# EAGLE design BSPD Test Board rev4 (EAGLE 8.4.1)
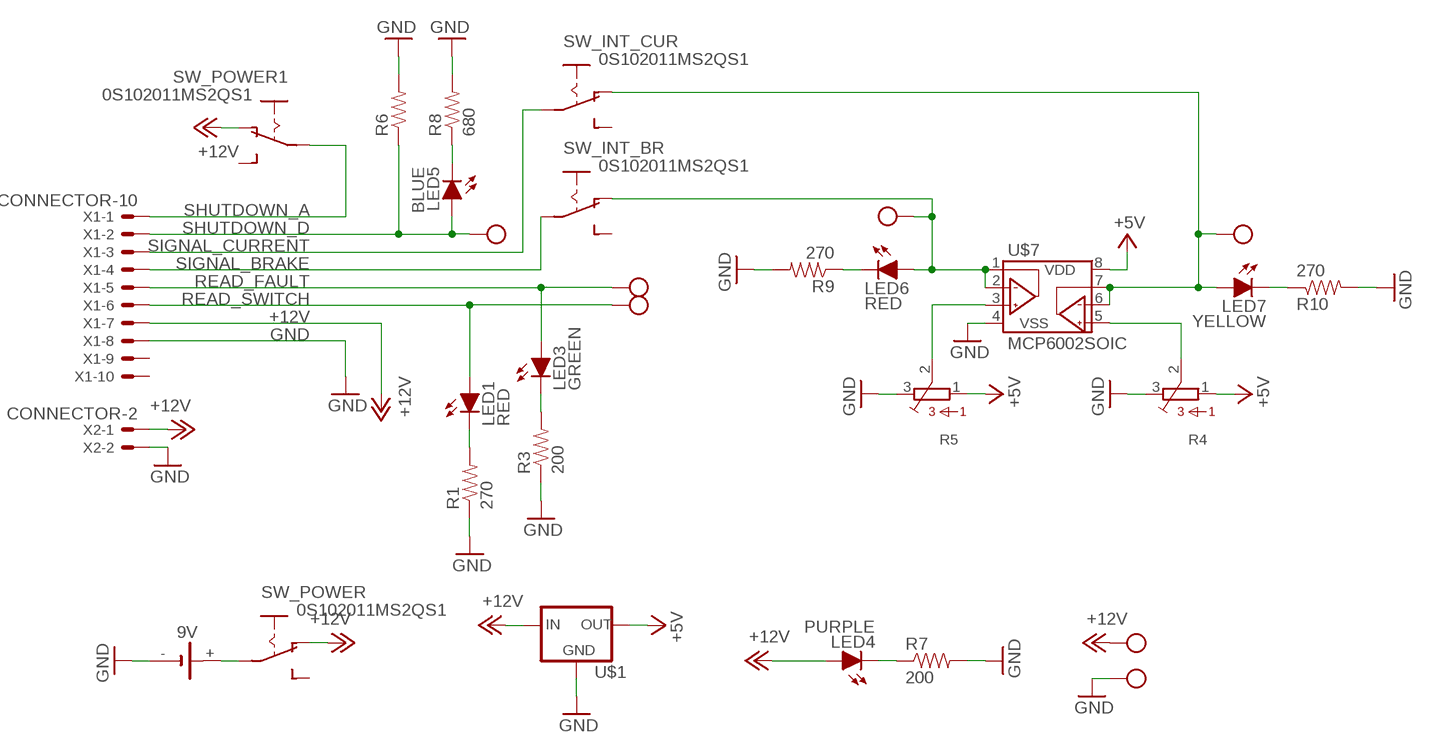
[diagram p0: schematic, sheet 1]

## Parts
9V  1291-79  [1291-79]
LED1  RED  LED-5MM  [LED-5MM]
LED3  GREEN  LED-5MM  [LED-5MM]
LED4  PURPLE  LED-0805  [LED-805]
LED5  BLUE  LED-5MM  [LED-5MM]
LED6  RED  LED-0805  [LED-805]
LED7  YELLOW  LED-0805  [LED-805]
R1  270  RESISTOR0805-RES  [0805]
R3  200  RESISTOR0805-RES  [0805]
R4  TRIMPOT_3296C  [TRIMPOT_3296]
R5  TRIMPOT_3296C  [TRIMPOT_3296]
R6  RESISTORPTH-1/2W  [AXIAL-0.5]
R7  200  RESISTOR0805-RES  [0805]
R8  680  RESISTOR0805-RES  [0805]
R9  270  RESISTOR0805-RES  [0805]
R10  270  RESISTOR0805-RES  [0805]
SW_INT_BR  0S102011MS2QS1  [0S102011MS2QS1]
SW_INT_CUR  0S102011MS2QS1  [0S102011MS2QS1]
SW_POWER  0S102011MS2QS1  [0S102011MS2QS1]
SW_POWER1  0S102011MS2QS1  [0S102011MS2QS1]
U$1  5VREG_LM340-NLM340MPX-5.0/NOPB  [SOT223]
U$2  TEST_POINT  [TEST_POINT]
U$3  TEST_POINT  [TEST_POINT]
U$4  TEST_POINT  [TEST_POINT]
U$5  TEST_POINT  [TEST_POINT]
U$6  TEST_POINT  [TEST_POINT]
U$7  MCP6002SOIC  [SOIC-08]
U$8  TEST_POINT  [TEST_POINT]
U$10  TEST_POINT  [TEST_POINT]
X1  CONNECTOR-10  [MINIFIT_5566-10]
X2  CONNECTOR-2  [MINIFIT_5566-2]

## Nets
+5V: R4.1 R5.1 U$1.3(OUT) U$7.8(VDD)
+12V: LED4.A SW_POWER1.P$1(O) SW_POWER.P$1(O) U$1.1(IN) U$5.P$1 X1.7 X2.1
GND: 9V.- R1.1 R3.1 R4.3 R5.3 R6.P$2 R7.2 R8.2 R9.2 R10.2 U$1.2(GND) U$1.4(GND) U$6.P$1 U$7.4(VSS) X1.8 X2.2
N$1: LED1.K(C) R1.2
N$3: LED3.K(C) R3.2
N$4: R4.2 U$7.5(VINB+)
N$5: R5.2 U$7.3(VINA+)
N$6: 9V.+ SW_POWER.P$2(P)
N$7: LED4.C R7.1
N$8: LED6.A SW_INT_BR.P$1(O) U$3.P$1 U$7.1(VOUTA) U$7.2(VINA-)
N$9: LED7.A SW_INT_CUR.P$1(O) U$2.P$1 U$7.6(VINB-) U$7.7(VOUTB)
N$10: LED6.C R9.1
N$11: LED5.K(C) R8.1
N$12: LED7.C R10.1
N$13: SW_POWER1.P$2(P) X1.1
READ_FAULT: LED3.A U$8.P$1 X1.5
READ_SWITCH: LED1.A U$10.P$1 X1.6
SHUTDOWN_D: LED5.A R6.P$1 U$4.P$1 X1.2
SIGNAL_BRAKE: SW_INT_BR.P$2(P) X1.4
SIGNAL_CURRENT: SW_INT_CUR.P$2(P) X1.3
Unconnected: SW_INT_BR.P$3(S) SW_INT_CUR.P$3(S) SW_POWER1.P$3(S) SW_POWER.P$3(S) X1.9 X1.10

## Notes on the sheet
- SHUTDOWN_A

## Library data of the parts
9V = HyTechDevices:1291-79: Keystone Electronics 9V 9 Volt battery holder 1291-79
LED1 LED3-LED7 = HyTechDevices:LED: Light Emitting Diode (LED) Source: Dangerous Prototypes Eagle Library <https://github.com/DangerousPrototypes/Eagle_Part_Library>
R1 R3 R6-R10 = HyTechDevices:RESISTOR: Resistor Basic schematic elements and footprints for 0603, 1206, and PTH resistors.
R4 R5 = HyTechDevices:TRIMPOT_3296: 3296 Series 3/8" Square Trimmer Source <https://github.com/chiengineer/Eagle-Libraries/blob/master/Potentiometers/bourns.lbr>
SW_INT_BR SW_INT_CUR SW_POWER SW_POWER1 = HyTechDevices:0S102011MS2QS1: Slide Switch 0S102011MS2QS1
U$1 = HyTechDevices:5VREG_LM340-N: Voltage Regulator 5v linear voltage regulator Datasheet <http://www.mouser.com/ProductDetail/Texas-Instruments/LM340MPX-50-NOPB/?qs=X1J7HmVL2ZGZwtTFRQ9ItA%3D%3D> MAX current out: 1.5A MAX voltage in: 35V
U$2-U$6 U$8 U$10 = HyTechDevices:TEST_POINT: Keystone Electronics Test Point 5005
U$7 = HyTechDevices:MCP6002: Microchip MCP6002 Dual Channel Op Amp
X1 = HyTechDevices:CONNECTOR-10: Mini-Fit Junior connector 10 pole Source: http://www.molex.com; OC_FARNELL: unknown; OC_NEWARK: unknown
X2 = HyTechDevices:CONNECTOR-2: Mini-Fit Junior connector 2 pole Source: http://www.molex.com; OC_FARNELL: 1822072; OC_NEWARK: unknown

## Board
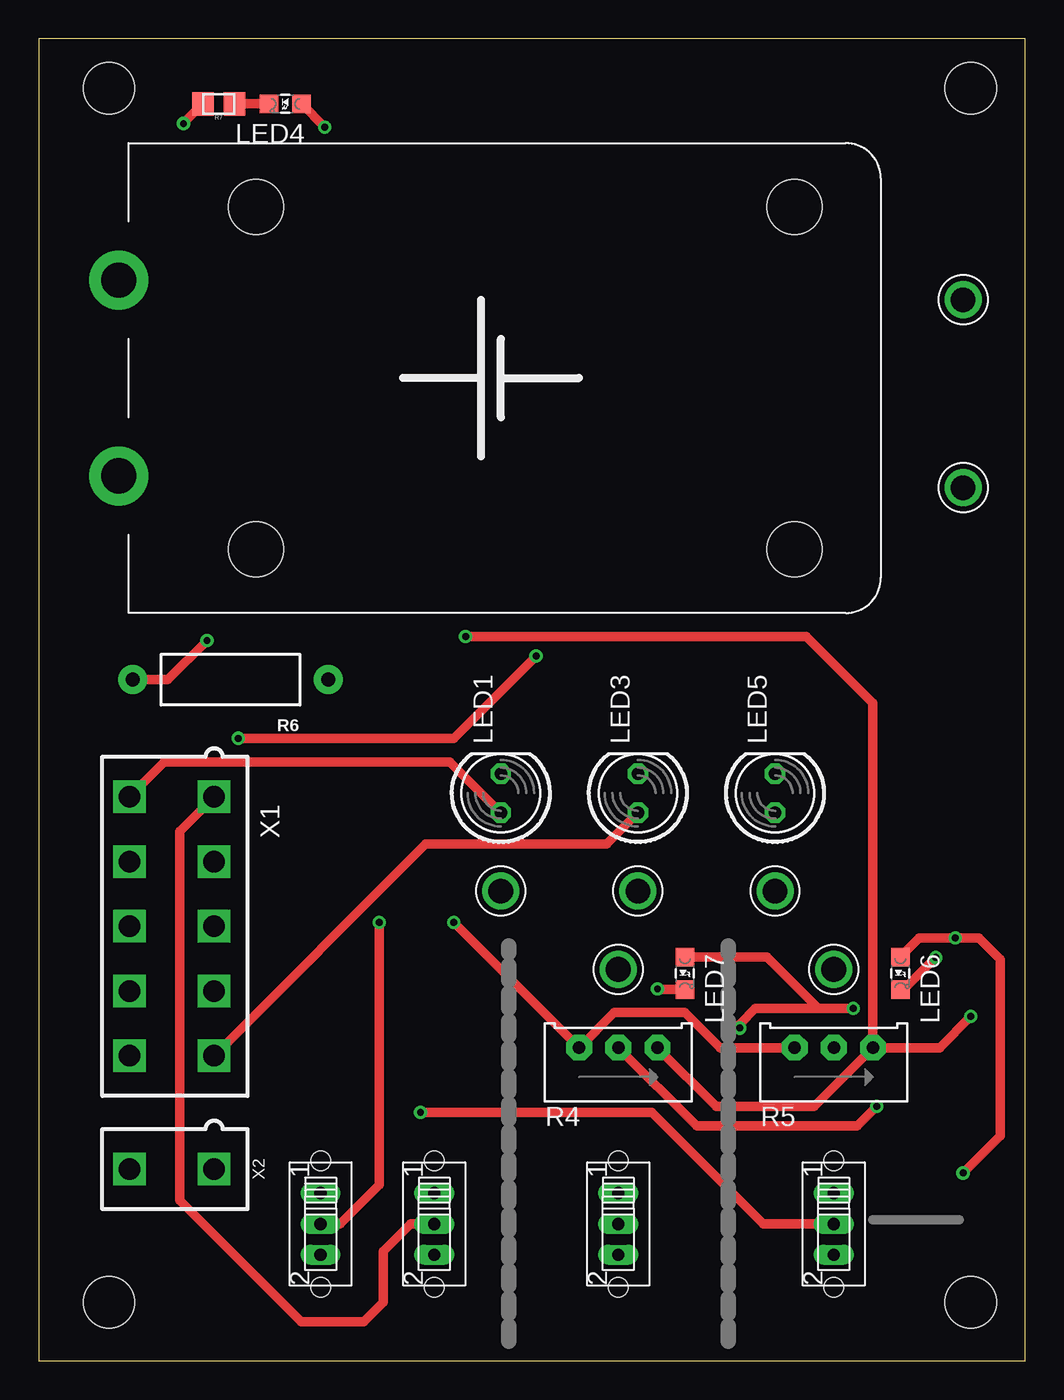
[diagram p1: board, top side]
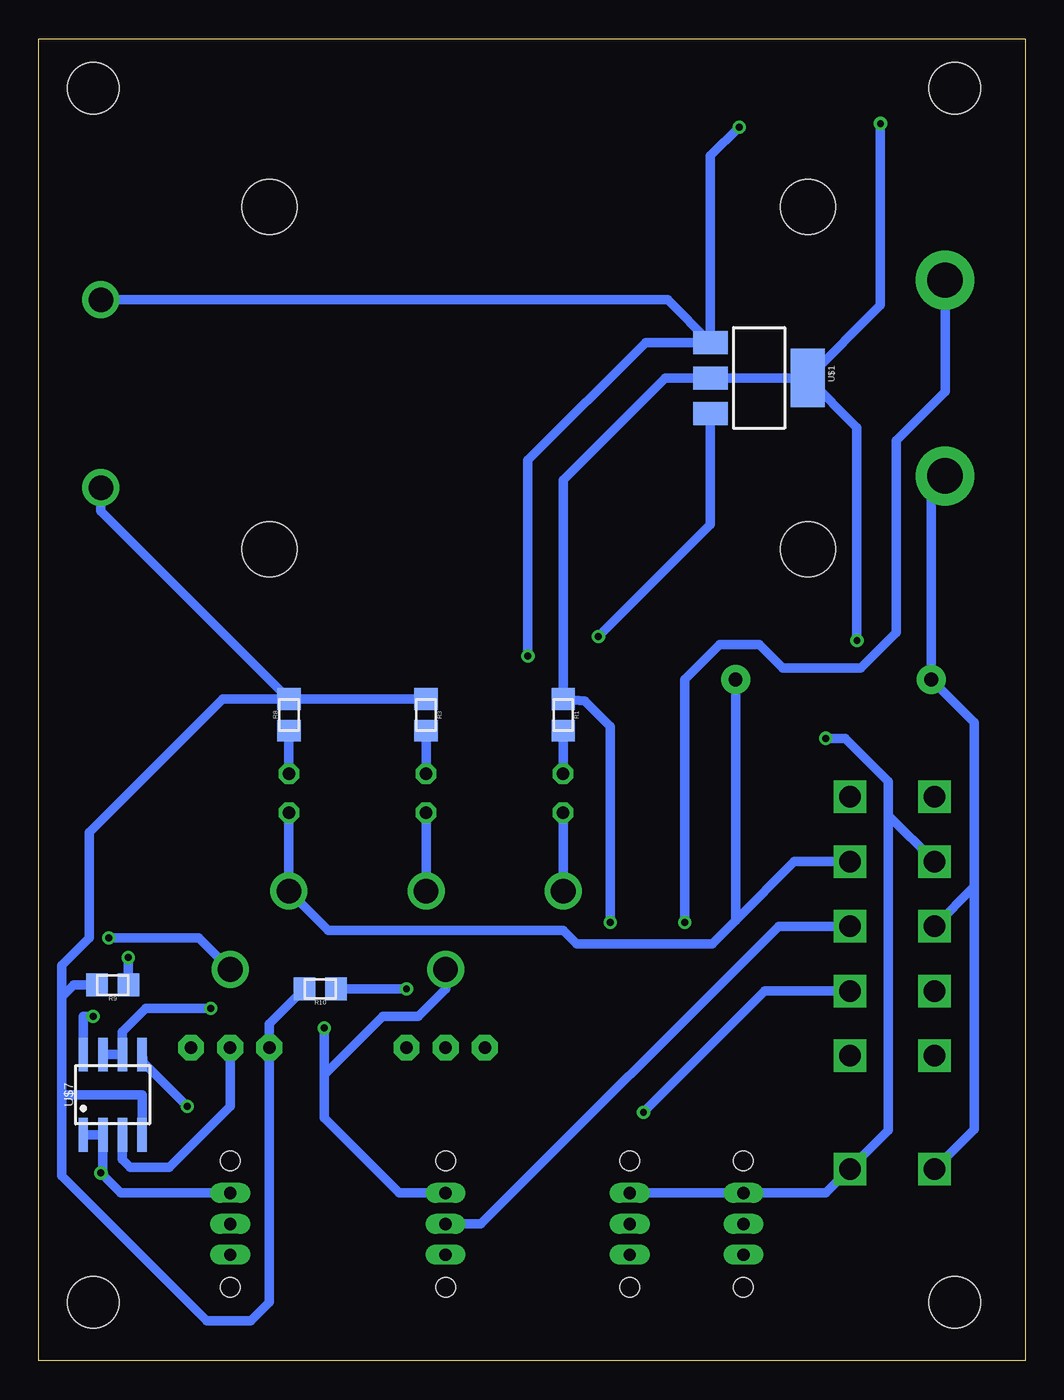
[diagram p2: board, bottom side, seen from below]

Size 63.99 x 85.78 mm. Coordinates in mm from the lower left corner, seen from the top.
Outline: 0,0 63.99,0 63.99,85.78 0,85.78 0,0
Copper layers (1*16): Top 0.035mm / dielectric 1.5mm / Bottom 0.035mm
Design rules "DRC Advanced Circuits": minimum track width 6mil, minimum drill 15mil, track to track 6mil, track to pad 6mil, pad to pad 6mil, via to via 6mil, smd to smd 6mil, copper to edge 40mil, drill to drill 6mil, minimum pad ring 10mil, minimum via ring 8mil, stop-mask expansion 4mil, vias tented up to drill 0mil, thermal gap 10mil
Holes 3.33 mm at 4.57,3.81 60.45,3.81 60.45,82.55 4.57,82.55

### Footprints (pad centres in the part's own frame; a part is rotated, then mirrored left to right if it is on the bottom)
1291-79 = drill 2.286 pad 3.81: + 43.815,-6.35; - 43.815,6.35 | hole 3.556: 0,11.113; 0,-11.113; 34.925,-11.113; 34.925,11.113
LED-5MM = drill 0.813 octagon: A -1.27,0; K 1.27,0
LED-805 = smd 1.2 x 1.2: A 0,-1.05; C 0,1.05
0805 = smd 1.4 x 1.5: 1 -1.025,0; 2 1.025,0
TRIMPOT_3296 = drill 0.813 pad 1.676 octagon: 1 2.54,1.27; 2 0,1.27; 3 -2.54,1.27
AXIAL-0.5 = drill 0.9 pad 1.88: P$1 -6.35,0; P$2 6.35,0
0S102011MS2QS1 = drill 0.8 long: P$1 -2,0; P$2 0,0; P$3 2,0 | hole 1.27: 4.102,0; -4.102,0
SOT223 = smd 1.5 x 2.235: 1 -2.3,-3.15; 2 0,-3.15; 3 2.3,-3.15 | smd 3.8 x 2.2: 4 0,3.15
TEST_POINT = drill 1.6: P$1 0,0
SOIC-08 = smd 0.6 x 2.2: 1 -1.905,-2.6; 2 -0.635,-2.6; 3 0.635,-2.6; 4 1.905,-2.6; 5 1.905,2.6; 6 0.635,2.6; 7 -0.635,2.6; 8 -1.905,2.6
MINIFIT_5566-10 = drill 1.4 square: 1 8.4,-2.75; 2 4.2,-2.75; 3 0,-2.75; 4 -4.2,-2.75; 5 -8.4,-2.75; 6 8.4,2.75; 7 4.2,2.75; 8 0,2.75; 9 -4.2,2.75; 10 -8.4,2.75
MINIFIT_5566-2 = drill 1.4 square: 1 0,-2.75; 2 0,2.75

### Placement (x,y rotation side)
9V  49.02,63.75 180 top
LED1  29.97,36.83 90 top
LED3  38.86,36.83 90 top
LED4  16,81.53 90 top
LED5  47.75,36.83 90 top
LED6  55.88,25.15 180 top
LED7  41.91,25.15 180 top
R1  29.97,41.91 270 bottom
R3  38.86,41.91 270 bottom
R4  37.59,19.05 0 top
R5  51.56,19.05 0 top
R6  12.45,44.2 180 top
R7  11.68,81.53 180 top
R8  47.75,41.91 90 bottom
R9  59.18,24.38 180 bottom
R10  45.72,24.13 180 bottom
SW_INT_BR  51.56,8.89 270 top
SW_INT_CUR  37.59,8.89 270 top
SW_POWER  18.29,8.89 270 top
SW_POWER1  25.65,8.89 270 top
U$1  17.27,63.75 270 bottom
U$2  37.59,25.4 0 top
U$3  51.56,25.4 0 top
U$4  47.75,30.48 90 top
U$5  59.94,68.83 0 top
U$6  59.94,56.64 0 top
U$7  59.18,17.27 0 bottom
U$8  38.86,30.48 270 top
U$10  29.97,30.48 270 top
X1  8.64,28.19 90 top
X2  8.64,12.45 90 top

### Tracks (layer width: path | path; a pad name or v marks a point on that pad's centre or on a via)
+5V  (via drill 0.45)
  Top 0.61: R5.1 54.1,42.67 49.78,46.99 v27.69,46.99 | R4.1 43.94,16.51 50.29,16.51 R5.1 | v60.45,22.35 58.42,20.32 R5.1
  Bottom 0.61: U$7.8 61.09,22.35 v60.45,22.35 | U$1.3 20.42,54.25 v27.69,46.99
+12V  (via drill 0.45)
  Top 0.61: v32.26,45.72 26.92,40.39 v12.95,40.39 | LED4.A v18.56,80.03
  Bottom 0.61: U$1.1 23.2,68.83 U$5.P$1 | 8.89,28.45 8.89,24.13 8.89,18.03 | 8.89,28.45 8.89,28.76 | SW_POWER1.P$1 SW_POWER.P$1 14.48,10.89 12.94,10.89 X2.1 8.89,14.94 8.89,18.03 | 8.89,31.5 8.89,28.45 | 8.89,36.32 8.89,31.5 | U$1.1 24.62,66.05 32.26,58.42 v32.26,45.72 | v18.56,80.03 20.42,78.16 U$1.1 | 8.89,30.06 8.89,31.5 | v12.95,40.39 11.68,40.39 8.89,37.59 8.89,36.32 | 8.89,35.4 8.89,18.03 | X1.7 8.89,35.4 | 8.89,35.4 8.89,36.32
GND  (via drill 0.45)
  Top 0.61: v26.92,28.45 R4.3 37.34,22.61 41.91,22.61 44.2,20.32 R5.3 | v10.92,46.74 8.38,44.2 R6.P$2 | R7.2 9.4,80.27 v9.4,80.26
  Bottom 0.61: R3.1 R8.2 | U$1.4 U$1.2 23.37,63.75 29.97,57.15 R1.1 28.59,42.81 26.92,41.15 26.92,29.46 v26.92,28.45 | U$7.4 57.28,17.27 62.48,17.27 | 62.48,17.27 62.48,22.61 62.48,23.62 | 62.48,17.27 62.48,12.45 62.48,12 53.09,2.6 50.55,2.6 50.23,2.6 49.02,3.81 R5.3 49.02,21.85 R10.2 | 9V.- 6.1,56.52 R6.P$2 3.3,41.4 3.3,30.78 | U$1.4 10.92,60.55 v10.92,46.74 | v9.4,80.26 9.4,68.48 U$1.4 | U$6.P$1 59.94,55.13 R8.2 | 62.48,23.62 62.48,25.65 60.71,27.43 60.71,34.29 52.06,42.94 R8.2 | R9.2 61.72,24.38 62.48,23.62 | X1.8 3.3,30.78 | X2.2 3.3,15.03 3.3,30.78
N$1
  Bottom 0.61: R1.2 LED1.K
N$3
  Bottom 0.61: R3.2 LED3.K
N$4  (via drill 0.45)
  Top 0.61: v54.36,16.51 53.09,15.24 42.67,15.24 R4.2
  Bottom 0.61: U$7.5 57.21,19.36 v54.36,16.51
N$5
  Bottom 0.61: U$7.3 58.55,13.08 58.04,12.57 55.5,12.57 51.56,16.51 R5.2
N$6  (via drill 0.45)
  Top 0.61: SW_POWER.P$2 19.56,8.89 22.1,11.43 22.1,19.56 v22.1,28.45
  Bottom 0.61: 9V.+ 5.21,62.87 8.38,59.69 8.38,47.24 10.67,44.96 15.75,44.96 17.27,46.48 19.81,46.48 22.1,44.2 v22.1,28.45
N$7
  Top 0.61: R7.1 LED4.C
N$8  (via drill 0.45)
  Top 0.61: LED6.A 57.12,27.43 v59.44,27.43 60.96,27.43 62.36,26.04 62.36,14.61 v59.94,12.19
  Bottom 0.61: U$7.1 U$7.2 59.82,12.19 v59.94,12.19 59.97,12.19 58.67,10.89 SW_INT_BR.P$1 | U$3.P$1 53.59,27.43 v59.44,27.43
N$9  (via drill 0.45)
  Top 0.61: LED7.A 47.21,26.2 50.55,22.86 | 50.55,22.86 v52.83,22.86 | 50.55,22.86 46.48,22.86 45.47,21.84 v45.47,21.59
  Bottom 0.61: U$7.7 U$7.6 58.55,21.34 57.02,22.86 v52.83,22.86 | SW_INT_CUR.P$1 40.6,10.89 45.47,15.75 45.47,18.54 | 45.47,18.54 v45.47,21.59 | 45.47,18.54 41.66,22.35 39.37,22.35 37.59,24.13 U$2.P$1
N$10  (via drill 0.45)
  Top 0.61: v58.17,26.16 56.1,24.1 LED6.C
  Bottom 0.61: R9.1 58.16,26.15 v58.17,26.16
N$11
  Bottom 0.61: R8.1 LED5.K
N$12  (via drill 0.45)
  Top 0.61: LED7.C 40.17,24.1 v40.13,24.13
  Bottom 0.61: v40.13,24.13 R10.1
N$13
  Top 0.61: SW_POWER1.P$2 24.13,8.89 22.35,7.11 22.35,3.81 21.08,2.54 17.02,2.54 9.14,10.41 9.14,34.35 X1.1
READ_FAULT
  Top 0.61: LED3.A 36.83,33.53 25.12,33.53 X1.5
  Bottom 0.61: LED3.A U$8.P$1
READ_SWITCH
  Top 0.61: LED1.A 26.67,38.86 8.15,38.86 X1.6
  Bottom 0.61: LED1.A U$10.P$1
SHUTDOWN_D
  Bottom 0.61: LED5.A U$4.P$1 45.21,27.94 29.97,27.94 29.09,27.06 20.32,27.06 18.8,28.58 | R6.P$1 18.8,28.58 | 12.06,32.39 X1.2 14.99,32.39 18.8,28.58
SIGNAL_BRAKE  (via drill 0.45)
  Top 0.61: SW_INT_BR.P$2 46.99,8.89 39.75,16.13 v24.77,16.13
  Bottom 0.61: v24.77,16.13 16.9,23.99 X1.4
SIGNAL_CURRENT
  Bottom 0.61: SW_INT_CUR.P$2 35.31,8.89 16,28.19 X1.3

### Text on the board
tDocu: HyTech 2018 BSPD Test Board rev4 | POWER | BATT | GND | SWITCH | FAULT | SHUTDOWN / CIRCUIT | Wipers: / CW→0V / CCW→5V | ON | External Power | OFF | BATT | SC_IN | CURRENT | BRAKE